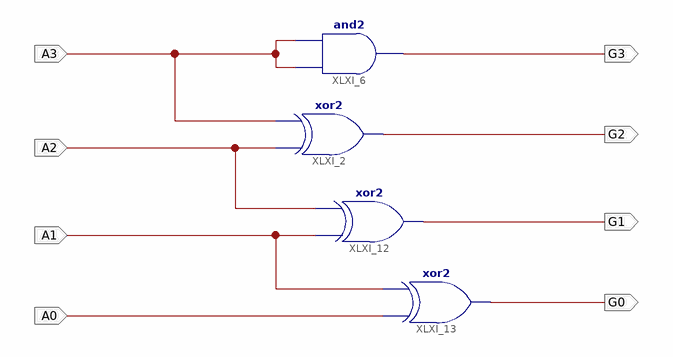
[diagram p0: schematic sheet 1]
// Xilinx ISE schematic BinaryToGrayModule.sch (spartan3e) as structural Verilog: 4 symbols, 8 ports
module BinaryToGrayModule (
  input  A0,
  input  A1,
  input  A2,
  input  A3,
  output G3,
  output G1,
  output G2,
  output G0
);

  and XLXI_6 (G3, A3, A3);
  xor XLXI_2 (G2, A2, A3);
  xor XLXI_12 (G1, A1, A2);
  xor XLXI_13 (G0, A0, A1);
endmodule
